# Altium schematic sheet Power and Clocks.SCHDOC
size B
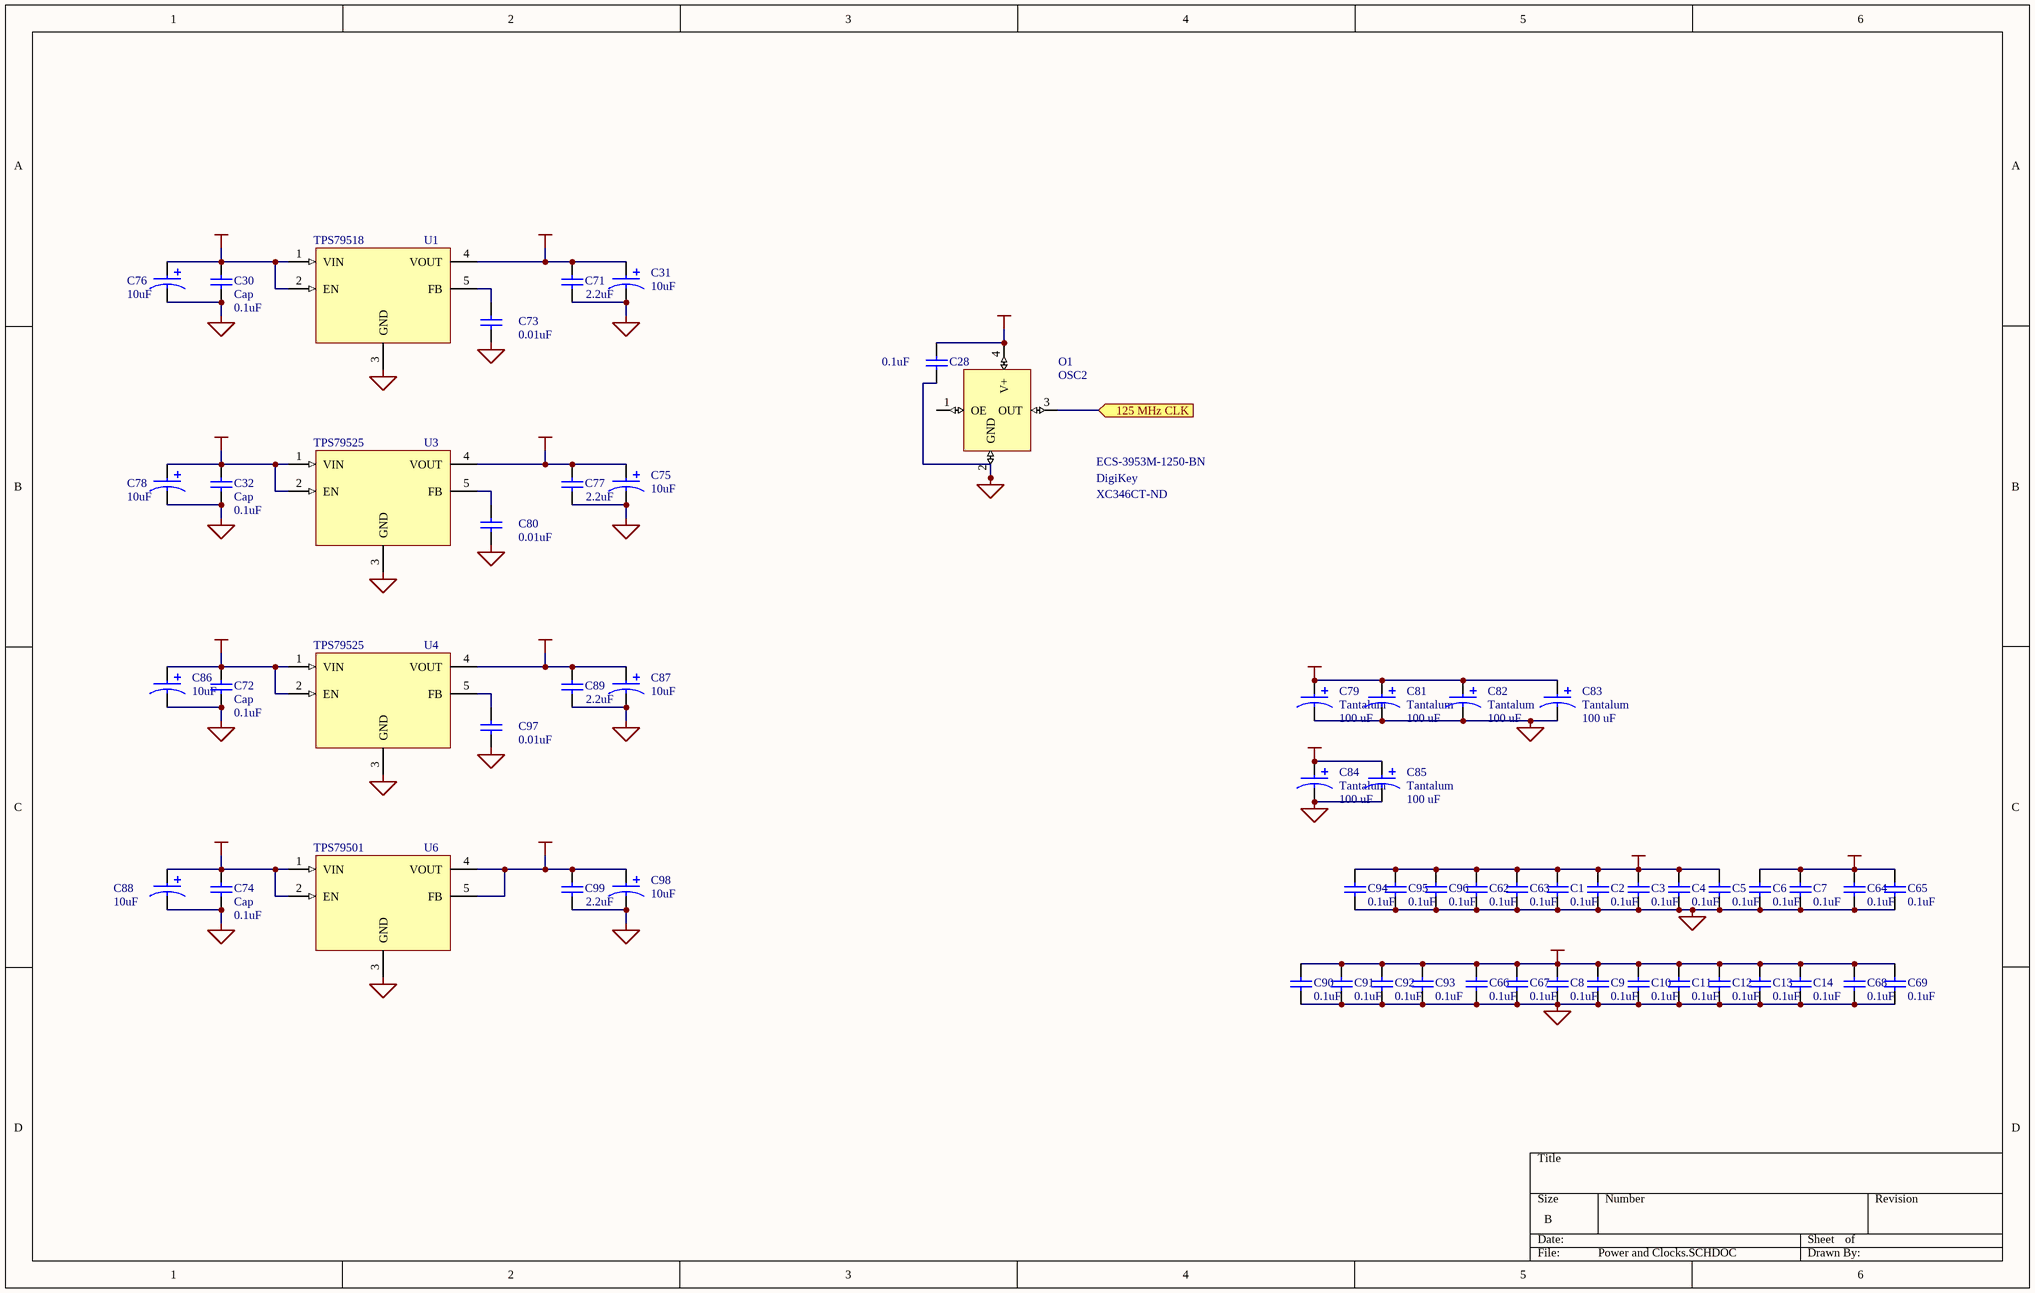
[diagram p0: Power and Clocks.SCHDOC]

## Parts
C1  value 0.1uF  [0603]  (hidden comment: Cap)
C2  value 0.1uF  [0603]  (hidden comment: Cap)
C3  value 0.1uF  [0603]  (hidden comment: Cap)
C4  value 0.1uF  [0603]  (hidden comment: Cap)
C5  value 0.1uF  [0603]  (hidden comment: Cap)
C6  value 0.1uF  [0603]  (hidden comment: Cap)
C7  value 0.1uF  [0603]  (hidden comment: Cap)
C8  value 0.1uF  [0603]  (hidden comment: Cap)
C9  value 0.1uF  [0603]  (hidden comment: Cap)
C10  value 0.1uF  [0603]  (hidden comment: Cap)
C11  value 0.1uF  [0603]  (hidden comment: Cap)
C12  value 0.1uF  [0603]  (hidden comment: Cap)
C13  value 0.1uF  [0603]  (hidden comment: Cap)
C14  value 0.1uF  [0603]  (hidden comment: Cap)
C28  value 0.1uF  [CC1608-0603]  (hidden comment: Cap)
C30  Cap  value 0.1uF  [CC1608-0603]
C31  value 10uF  [6032]  (hidden comment: POLCAP2)
C32  Cap  value 0.1uF  [CC1608-0603]
C62  value 0.1uF  [0603]  (hidden comment: Cap)
C63  value 0.1uF  [0603]  (hidden comment: Cap)
C64  value 0.1uF  [0603]  (hidden comment: Cap)
C65  value 0.1uF  [0603]  (hidden comment: Cap)
C66  value 0.1uF  [0603]  (hidden comment: Cap)
C67  value 0.1uF  [0603]  (hidden comment: Cap)
C68  value 0.1uF  [0603]  (hidden comment: Cap)
C69  value 0.1uF  [0603]  (hidden comment: Cap)
C71  value 2.2uF  [1206]  (hidden comment: Cap)
C72  Cap  value 0.1uF  [CC1608-0603]
C73  value 0.01uF  [0603]  (hidden comment: Cap)
C74  Cap  value 0.1uF  [CC1608-0603]
C75  value 10uF  [6032]  (hidden comment: POLCAP2)
C76  value 10uF  [6032]  (hidden comment: POLCAP2)
C77  value 2.2uF  [1206]  (hidden comment: Cap)
C78  value 10uF  [6032]  (hidden comment: POLCAP2)
C79  Tantalum  value 100 uF  [6032]
C80  value 0.01uF  [0603]  (hidden comment: Cap)
C81  Tantalum  value 100 uF  [6032]
C82  Tantalum  value 100 uF  [6032]
C83  Tantalum  value 100 uF  [6032]
C84  Tantalum  value 100 uF  [6032]
C85  Tantalum  value 100 uF  [6032]
C86  value 10uF  [6032]  (hidden comment: POLCAP2)
C87  value 10uF  [6032]  (hidden comment: POLCAP2)
C88  value 10uF  [6032]  (hidden comment: POLCAP2)
C89  value 2.2uF  [1206]  (hidden comment: Cap)
C90  value 0.1uF  [0603]  (hidden comment: Cap)
C91  value 0.1uF  [0603]  (hidden comment: Cap)
C92  value 0.1uF  [0603]  (hidden comment: Cap)
C93  value 0.1uF  [0603]  (hidden comment: Cap)
C94  value 0.1uF  [0603]  (hidden comment: Cap)
C95  value 0.1uF  [0603]  (hidden comment: Cap)
C96  value 0.1uF  [0603]  (hidden comment: Cap)
C97  value 0.01uF  [0603]  (hidden comment: Cap)
C98  value 10uF  [6032]  (hidden comment: POLCAP2)
C99  value 2.2uF  [1206]  (hidden comment: Cap)
O1  OSC2  Part: ECS-3953M-1250-BN  Vendor: DigiKey  VendorPart: XC346CT-ND  [ECS-3953M]
U1  TPS79518  [SOT223-5/Simple]
U3  TPS79525  [SOT223-5/Simple]
U4  TPS79525  [SOT223-5/Simple]
U6  TPS79501  [SOT223-5/Simple]

## Ports
125 MHz CLK (in)

## Nets
+1.2VCC: C6.2 C7.2 C64.2 C65.2 C98.1 C99.2 U6.4(VOUT) U6.5(FB)
+1.8VCC: C31.1 C71.2 C84.1 C85.1 U1.4(VOUT)
+2.5VCC: C1.2 C2.2 C3.2 C4.2 C5.2 C62.2 C63.2 C75.1 C77.2 C94.2 C95.2 C96.2 U3.4(VOUT)
+2.5VPHY: C87.1 C89.2 U4.4(VOUT)
GND: C1.1 C2.1 C3.1 C4.1 C5.1 C6.1 C7.1 C8.1 C9.1 C10.1 C11.1 C12.1 C13.1 C14.1 C28.1 C30.1 C31.2 C32.1 C62.1 C63.1 C64.1 C65.1 C66.1 C67.1 C68.1 C69.1 C71.1 C72.1 C73.1 C74.1 C75.2 C76.2 C77.1 C78.2 C79.2 C80.1 C81.2 C82.2 C83.2 C84.2 C85.2 C86.2 C87.2 C88.2 C89.1 C90.1 C91.1 C92.1 C93.1 C94.1 C95.1 C96.1 C97.1 C98.2 C99.1 O1.2(GND) U1.3(GND) U3.3(GND) U4.3(GND) U6.3(GND)
VCC: C8.2 C9.2 C10.2 C11.2 C12.2 C13.2 C14.2 C28.2 C30.2 C32.2 C66.2 C67.2 C68.2 C69.2 C72.2 C74.2 C76.1 C78.1 C79.1 C81.1 C82.1 C83.1 C86.1 C88.1 C90.2 C91.2 C92.2 C93.2 O1.4(V+) U1.1(VIN) U1.2(EN) U3.1(VIN) U3.2(EN) U4.1(VIN) U4.2(EN) U6.1(VIN) U6.2(EN)
125 MHz CLK: O1.3(OUT) ; port 125 MHz CLK
NetC73_2: C73.2 U1.5(FB)
NetC80_2: C80.2 U3.5(FB)
NetC97_2: C97.2 U4.5(FB)

Not connected (* = marked no-connect by the designer): O1 1(OE)

## Library data of the parts
C1-C14 C28 C30 C32 C62-C69 C71-C74 C77 C80 C89-C97 C99 = Cap: Capacitor; Manufacturer: Generic Components; Class I: Passive; Published: 8-Jun-2000; Revision: July-2002: Re-released for DXP Platform.; Publisher: Altium Limited; Class II: Capacitor
C31 C75 C76 C78 C79 C81-C88 C98 = POLCAP2: Standard Capacitor
O1 = OSC2: ECS SMD Oscillator, ECS-3953M
U1 U3 U4 U6 = TPS795XX: TI Ultra-low-noise LDO